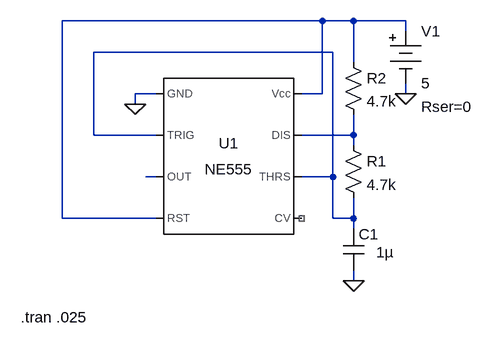
[diagram p0: schematic Astable.asc]
Astable.asc, the LTspice schematic file:
Version 4
SHEET 1 880 680
WIRE 304 48 -96 48
WIRE 352 48 304 48
WIRE 432 48 352 48
WIRE 432 64 432 48
WIRE 320 96 -48 96
WIRE 352 112 352 48
WIRE 48 160 16 160
WIRE 304 160 304 48
WIRE 304 160 272 160
WIRE 432 160 432 144
WIRE 16 176 16 160
WIRE -48 224 -48 96
WIRE 48 224 -48 224
WIRE 352 224 352 192
WIRE 352 224 272 224
WIRE 352 240 352 224
WIRE 48 288 32 288
WIRE 320 288 320 96
WIRE 320 288 272 288
WIRE -96 352 -96 48
WIRE 48 352 -96 352
WIRE 320 352 320 288
WIRE 352 352 352 320
WIRE 352 352 320 352
WIRE 352 368 352 352
WIRE 352 448 352 432
FLAG 16 176 0
FLAG 432 160 0
FLAG 352 448 0
SYMBOL Misc\\NE555 160 256 R0
SYMATTR InstName U1
SYMBOL Misc\\battery 432 48 R0
WINDOW 123 0 0 Left 0
WINDOW 39 24 132 Left 0
SYMATTR SpiceLine Rser=0
SYMATTR InstName V1
SYMATTR Value 5
SYMBOL res 336 224 R0
SYMATTR InstName R1
SYMATTR Value 4.7k
SYMATTR SpiceLine tol=1 pwr=0.1
SYMBOL cap 336 368 R0
WINDOW 3 51 36 Left 0
SYMATTR InstName C1
SYMATTR Value 1µ
SYMBOL res 336 96 R0
SYMATTR InstName R2
SYMATTR Value 4.7k
TEXT -160 504 Left 0 !.tran .025

The netlist it stands for:
* Astable.asc
XU1 0 N002 N004 N001 NC_01 N002 N003 N001 NE555  ; pins GND TRIG OUT RST CV THRS DIS Vcc
V1 N001 0 5 Rser=0
R1 N003 N002 4.7k tol=1 pwr=0.1
C1 N002 0 1µ
R2 N001 N003 4.7k
.tran .025
.lib NE555.sub
.backanno
.end